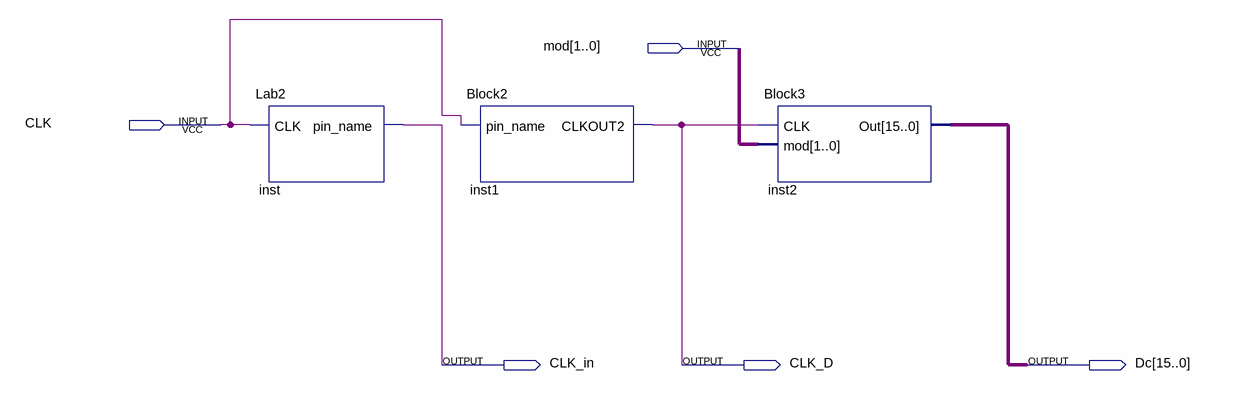
[diagram p0: schematic sheet]
// Quartus schematic main.bdf as structural Verilog: 3 symbols, 5 pins
module main (
  input  [1:0] mod,
  input  CLK,
  output CLK_in,
  output CLK_D,
  output [15:0] Dc
);

  Lab2 inst (.CLK(CLK), .pin_name(CLK_in));
  Block2 inst1 (.pin_name(CLK), .CLKOUT2(CLK_D));
  Block3 inst2 (.CLK(CLK_D), .mod(mod), .Out(Dc));
endmodule
